# EAGLE design driver (EAGLE 7.4.0)
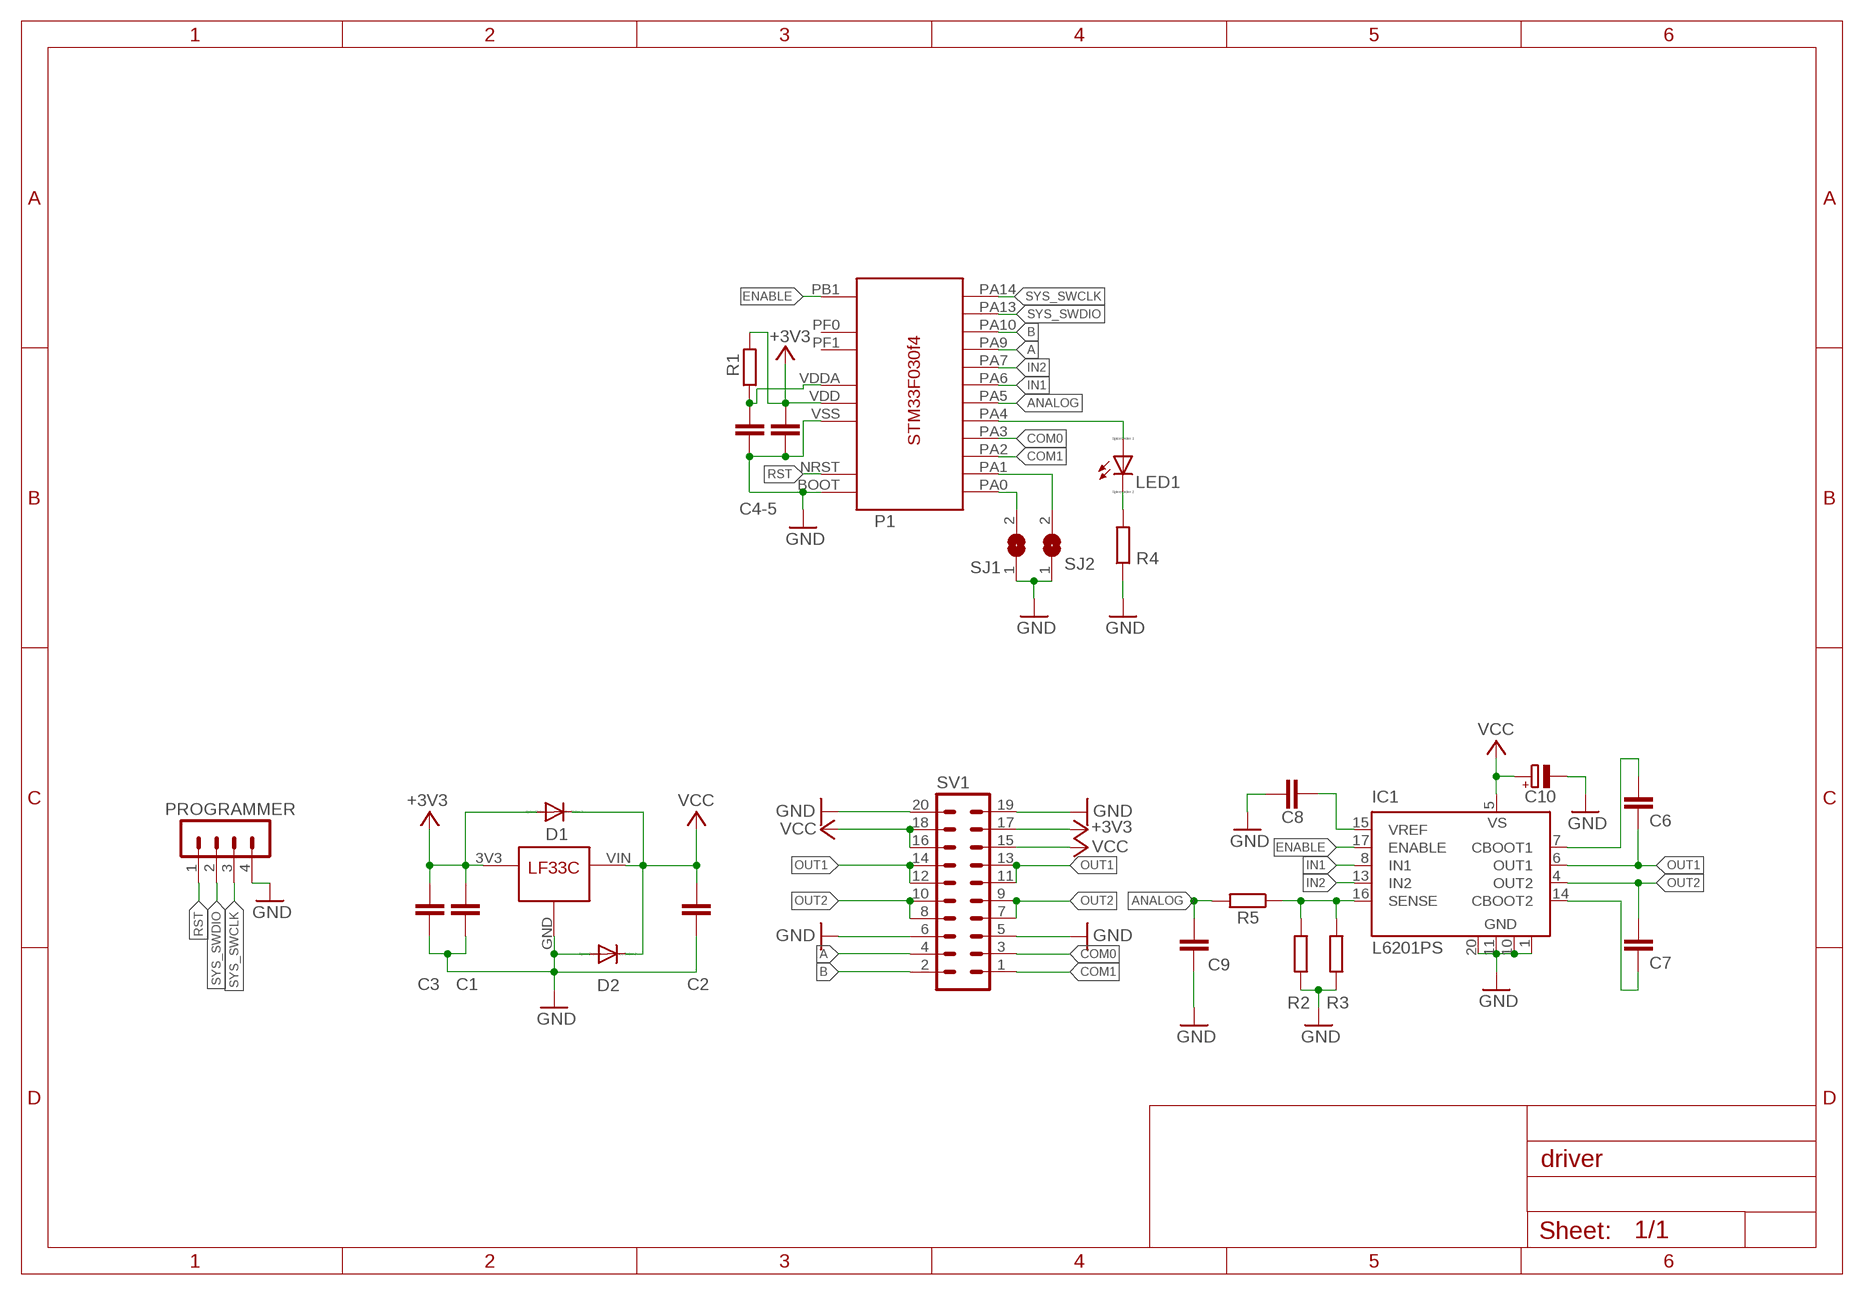
[diagram p0: schematic, sheet 1]

## Parts
C1  220k  C-EUC0603  [C0603]
C2  220k  C-EUC0603  [C0603]
C3  10u  C-EUC1206  [C1206]
C4  100K  C-EUC0603  [C0603]
C5  100K  C-EUC0603  [C0603]
C6  15K  C-EUC0603  [C0603]
C7  15K  C-EUC0603  [C0603]
C8  220k  C-EUC0603  [C0603]
C9  220k  C-EUC0603  [C0603]
C10  CPOL-EUD/7343-31W  [D/7343-31W]
D1  DIODE-MINIMELF  [MINIMELF]
D2  DIODE-MINIMELF  [MINIMELF]
IC1  L6201PS  [POWERSO-20]
LED1  LED_E  [LED_1206]
P1  STM32F030F4  [STM32F030F4]
PROGRAMMER  MA04-1  [MA04-1]
R1  R-EU_R1206  [R1206]
R2  R1  R-EU_R2512  [R2512]
R3  R1  R-EU_R2512  [R2512]
R4  R-EU_R0603  [R0603]
R5  R-EU_R0603  [R0603]
SJ1  SJ  [SJ]
SJ2  SJ  [SJ]
SV1  MA10-2W  [MA10-2W]
U$1  LF33C  [LF33C]

## Nets
+3V3: C1.1 C3.1 C5.1 D1.A P1.VDD R1.2 SV1.17 U$1.3V3
A: P1.PA9 SV1.4
ANALOG: C9.1 P1.PA5 R5.2
B: P1.PA10 SV1.2
COM0: P1.PA3 SV1.3
COM1: P1.PA2 SV1.1
ENABLE: IC1.17(ENABLE) P1.PB1
GND: C1.2 C2.2 C3.2 C4.2 C5.2 C8.2 C9.2 C10.- D2.A IC1.1(GND) IC1.10(GND) IC1.11(GND) IC1.20(GND) P1.BOOT P1.VSS PROGRAMMER.4 R2.1 R3.1 R4.1 SJ1.1 SJ2.1 SV1.5 SV1.6 SV1.19 SV1.20 U$1.GND
IN1: IC1.8(IN1) P1.PA6
IN2: IC1.13(IN2) P1.PA7
N$1: C4.1 P1.VDDA R1.1
N$2: C6.1 IC1.7(CBOOT1)
N$3: LED1.C R4.2
N$4: P1.PA0 SJ1.2
N$5: C7.2 IC1.14(CBOOT2)
N$6: C8.1 IC1.15(VREF)
N$7: P1.PA1 SJ2.2
N$8: LED1.A P1.PA4
N$10: IC1.16(SENSE) R2.2 R3.2 R5.1
OUT1: C6.2 IC1.6(OUT1) SV1.11 SV1.12 SV1.13 SV1.14
OUT2: C7.1 IC1.4(OUT2) SV1.7 SV1.8 SV1.9 SV1.10
RST: P1.NRST PROGRAMMER.1
SYS_SWCLK: P1.PA14 PROGRAMMER.3
SYS_SWDIO: P1.PA13 PROGRAMMER.2
VCC: C2.1 C10.+ D1.C D2.C IC1.5(VS) SV1.15 SV1.16 SV1.18 U$1.VIN
Unconnected: P1.PF0 P1.PF1

## Notes on the sheet
- C4-5

## Library data of the parts
C1-C9 = rcl:C-EU: CAPACITOR, European symbol
C10 = resistor:CPOL-EU: POLARIZED CAPACITOR, European symbol
D1 D2 = diode:DIODE-: DIODE
IC1 = st-microelectronics:L6201: DMOS FULL BRIDGE DRIVER; MF: Arrow Electronics; MPN: L6201PS; OC_FARNELL: 1077146; OC_NEWARK: 89K0751
LED1 = eagle-ltspice:LED_E: LED Source: http://www.osram.convergy.de Source: www.luxeon.com Source: www.kingbright.com; SPICEMODEL: NONE; SPICEPREFIX: D; SPICETYPE: diode
P1 = stm32f030f4:STM32F030F4
PROGRAMMER = con-lstb:MA04-1: PIN HEADER; OC_FARNELL: unknown; OC_NEWARK: unknown
R1-R5 = rcl:R-EU_: RESISTOR, European symbol
SJ1 SJ2 = jumper:SJ: SMD solder JUMPER
SV1 = con-lstb:MA10-2W: PIN HEADER; OC_FARNELL: unknown; OC_NEWARK: unknown
U$1 = regulator:LF33C

## Board
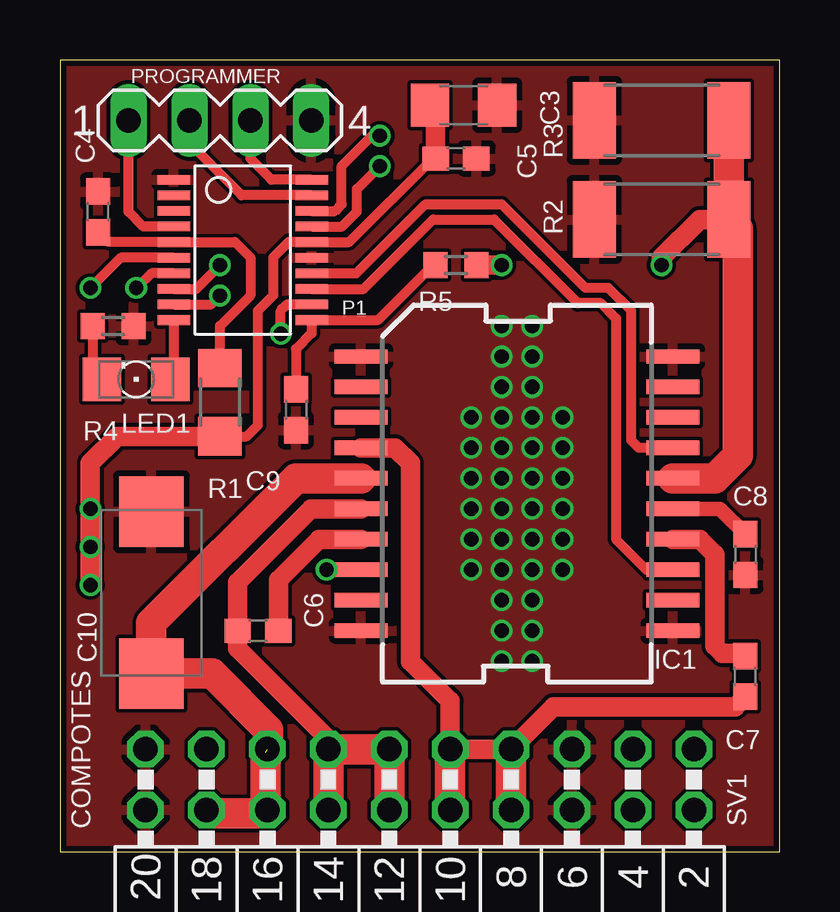
[diagram p1: board, top side]
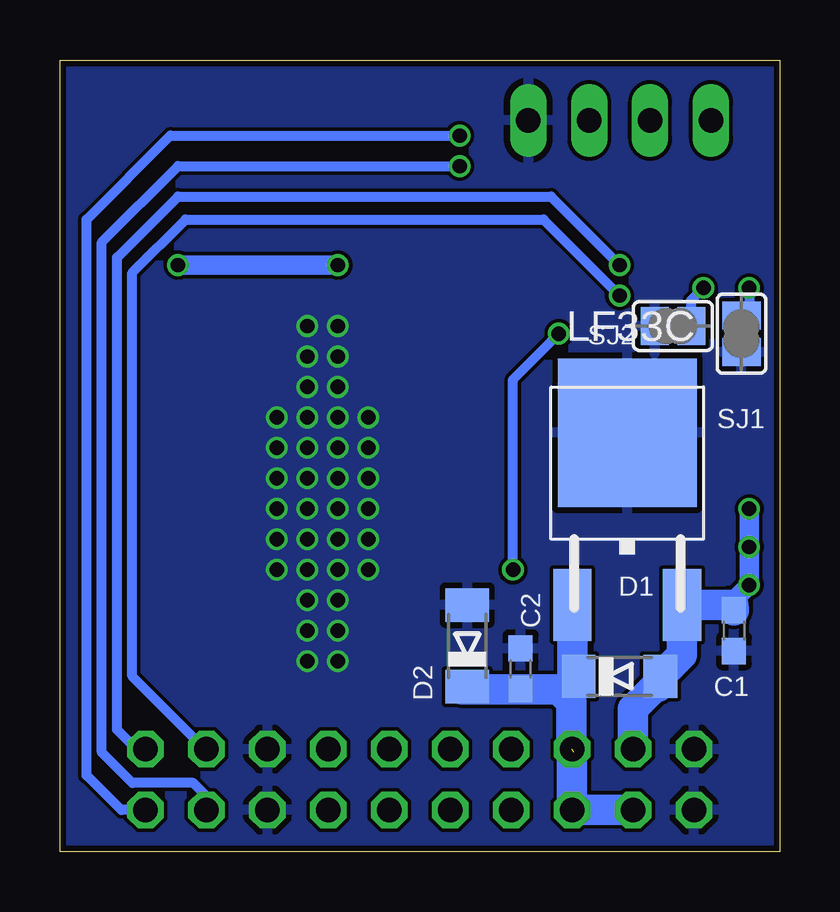
[diagram p2: board, bottom side, seen from below]

Size 30 x 33 mm. Coordinates in mm from the lower left corner, seen from the top.
Outline: 0,0 30,0 30,33 0,33 0,0
Copper layers (1*16): Top 0.035mm / dielectric 1.5mm / Bottom 0.035mm
Design rules "ITEADstudio_DRC": minimum track width 6mil, minimum drill 12mil, track to track 6mil, track to pad 6mil, pad to pad 6mil, via to via 6mil, smd to smd 0mil, copper to edge 10mil, drill to drill 10mil, minimum pad ring 10mil, minimum via ring 6mil, stop-mask expansion 2mil, vias tented up to drill 100mil, thermal gap 10mil

### Footprints (pad centres in the part's own frame; a part is rotated, then mirrored left to right if it is on the bottom)
C0603 = smd 1.1 x 1: 1 -0.85,0; 2 0.85,0
C1206 = smd 1.6 x 1.8: 1 -1.4,0; 2 1.4,0
D/7343-31W = smd 2.95 x 2.7: + 3.375,0; - -3.375,0
MINIMELF = smd 1.4 x 1.8: A 1.7,0; C -1.7,0
POWERSO-20 = smd 0.6 x 2.2: 1 -5.715,-6.5; 2 -4.445,-6.5; 3 -3.175,-6.5; 4 -1.905,-6.5; 5 -0.635,-6.5; 6 0.635,-6.5; 7 1.905,-6.5; 8 3.175,-6.5; 9 4.445,-6.5; 10 5.715,-6.5; 11 5.715,6.5; 12 4.445,6.5; 13 3.175,6.5; 14 1.905,6.5; 15 0.635,6.5; 16 -0.635,6.5; 17 -1.905,6.5; 18 -3.175,6.5; 19 -4.445,6.5; 20 -5.715,6.5
LED_1206 = smd 1.6 x 1.803: A -1.422,0; C 1.422,0
STM32F030F4 = smd 1.35 x 0.4: BOOT -2.875,2.925; NRST -2.875,0.975; PA0 -2.875,-0.325; PA1 -2.875,-0.975; PA2 -2.875,-1.625; PA3 -2.875,-2.275; PA4 -2.875,-2.925; PA5 2.875,-2.925; PA6 2.875,-2.275; PA7 2.875,-1.625; PA9 2.875,0.975; PA10 2.875,1.625; PA13 2.875,2.275; PA14 2.875,2.925; PB1 2.875,-0.975; PF0 -2.875,2.275; PF1 -2.875,1.625; VDD 2.875,0.325; VDDA -2.875,0.325; VSS 2.875,-0.325
MA04-1 = drill 1.016 long: 1 -3.81,0; 2 -1.27,0; 3 1.27,0; 4 3.81,0
R1206 = smd 1.6 x 1.803: 1 -1.422,0; 2 1.422,0
R2512 = smd 1.8 x 3.2: 1 -2.8,0; 2 2.8,0
R0603 = smd 1 x 1.1: 1 -0.85,0; 2 0.85,0
SJ = smd 1.168 x 1.6: 1 -0.762,0; 2 0.762,0
MA10-2W = drill 1.016 octagon: 1 -11.43,-1.27; 2 -11.43,1.27; 3 -8.89,-1.27; 4 -8.89,1.27; 5 -6.35,-1.27; 6 -6.35,1.27; 7 -3.81,-1.27; 8 -3.81,1.27; 9 -1.27,-1.27; 10 -1.27,1.27; 11 1.27,-1.27; 12 1.27,1.27; 13 3.81,-1.27; 14 3.81,1.27; 15 6.35,-1.27; 16 6.35,1.27; 17 8.89,-1.27; 18 8.89,1.27; 19 11.43,-1.27; 20 11.43,1.27
LF33C = smd 1.6 x 3: 3V3 2.285,-7.18; VIN -2.285,-7.18 | smd 5.8 x 6.2: GND 0,0

### Placement (x,y rotation side)
C1  1.91,9.21 270 bottom
C2  10.79,7.62 90 bottom
C3  16.83,31.11 0 top
C4  1.59,26.67 90 top
C5  16.51,28.89 0 top
C6  8.26,9.21 180 top
C7  28.57,7.3 90 top
C8  28.57,12.38 270 top
C9  9.84,18.41 270 top
C10  3.81,10.79 270 top
D1  6.67,7.3 0 bottom
D2  13.02,8.57 90 bottom
IC1  19.05,14.92 270 top
LED1  3.17,19.68 180 top
P1  7.62,25.08 0 top
PROGRAMMER  6.67,30.48 0 top
R1  6.67,18.73 270 top
R2  25.08,26.35 0 top
R3  25.08,30.48 0 top
R4  2.22,21.91 180 top
R5  16.51,24.45 180 top
SJ1  1.59,21.59 90 bottom
SJ2  4.45,21.91 0 bottom
SV1  15,3 180 top
U$1  6.35,17.46 0 bottom

### Tracks (layer width: path | path; a pad name or v marks a point on that pad's centre or on a via)
+3V3  (via drill 0.6)
  Top 0.406: R1.2 7.79,17.31 8.26,17.78 8.26,22.54 8.89,23.18 8.89,24.77 9.53,25.41 P1.VDD 12.06,25.41 15.54,28.89 C5.1
  Top 0.813: v1.27,11.11 1.27,16.19 2.39,17.31 R1.2 | C3.1 15.66,30.57 C5.1
  Bottom 0.813: 2.1,10.28 v1.27,11.11 v1.27,12.7 v1.27,14.29
  Bottom 1.27: SV1.17 6.11,5.96 5.08,6.99 5.08,6.87 D1.A 4.07,8.21 U$1.3V3 2.1,10.28 1.93,10.28 C1.1
A  (via drill 0.6)
  Top 0.406: P1.PA9 11.77,26.06 12.38,26.67 12.38,27.62 v13.34,28.57
  Bottom 0.406: SV1.4 23.89,2.3 24.45,2.86 26.99,2.86 28.26,4.13 28.26,25.4 25.08,28.57 v13.34,28.57
ANALOG
  Top 0.406: P1.PA5 10.54,22.16 | P1.PA5 10.49,21.61 9.84,20.95 C9.1 | P1.PA5 13.27,22.16 15.34,24.23 R5.2
B  (via drill 0.6)
  Top 0.406: P1.PA10 11.47,26.71 11.75,26.99 11.75,28.57 13.02,29.84 v13.34,29.84
  Bottom 0.406: SV1.2 27.45,1.73 28.89,3.17 28.89,26.35 25.4,29.84 v13.34,29.84
COM0  (via drill 0.6)
  Top 0.406: P1.PA3 6.3,22.81 v6.67,23.18
  Bottom 0.406: v6.67,23.18 9.84,26.35 24.77,26.35 26.99,24.13 26.99,7.3 23.95,4.27 SV1.3
COM1  (via drill 0.6)
  Top 0.406: P1.PA2 5.68,23.46 v6.67,24.45
  Bottom 0.406: SV1.1 26.81,4.27 27.62,5.08 27.62,24.77 25.08,27.3 9.53,27.3 v6.67,24.45
ENABLE
  Top 0.406: P1.PB1 12.36,24.11 15.24,26.99 18.41,26.99 21.91,23.5 22.86,23.5 23.81,22.54 23.81,17.14 24.13,16.83 IC1.17
GND  (via drill 0.6)
  other vias: 18.41,21.91 19.68,21.91 18.41,20.64 19.68,20.64 19.68,19.37 18.41,19.37 18.41,18.1 19.68,18.1 20.95,18.1 17.14,18.1 17.14,16.83 18.41,16.83 19.68,16.83 20.95,16.83 20.95,15.56 19.68,15.56 18.41,15.56 17.14,15.56 17.14,14.29 18.41,14.29 19.68,14.29 20.95,14.29 20.95,13.02 19.68,13.02 18.41,13.02 17.14,13.02 17.14,11.75 18.41,11.75 19.68,11.75 20.95,11.75 19.68,10.48 18.41,10.48 19.68,9.21 18.41,9.21 19.68,7.94 18.41,7.94
  pour Bottom: 33.02,-2.54 33.02,36.51 -3.81,36.51 -3.81,-2.54
  pour Top: 31.75,-1.27 31.75,35.24 -1.27,35.24 -1.27,-1.27
IN1  (via drill 0.6)
  Top 0.406: P1.PA6 9.47,22.81 9.21,22.54 v9.21,21.59 | IC1.8 v11.11,11.75
  Bottom 0.406: v11.11,11.75 11.11,19.68 v9.21,21.59
IN2
  Top 0.406: IC1.13 24.45,11.75 23.18,13.02 23.18,22.23 22.54,22.86 21.59,22.86 18.1,26.35 15.56,26.35 12.66,23.46 P1.PA7
N$1
  Top 0.406: C4.1 2.02,25.41 P1.VDDA 7.29,25.41 7.94,24.77 7.94,23.18 6.67,21.91 R1.1
N$2
  Top 0.813: C6.1 9.11,11.33 10.79,13.02 IC1.7
N$3
  Top 0.406: R4.2 1.37,20.07 LED1.C
N$4  (via drill 0.6)
  Top 0.406: P1.PA0 2.53,24.76 v1.27,23.5
  Bottom 0.406: v1.27,23.5 1.27,22.67 SJ1.2
N$5
  Top 0.813: IC1.14 26.67,13.02 27.3,12.38 27.3,8.57 27.62,8.26 28.47,8.26 C7.2
N$6
  Top 0.61: IC1.15 27.52,14.29 C8.1
N$7  (via drill 0.6)
  Top 0.406: P1.PA1 3.83,24.11 v3.17,23.5
  Bottom 0.406: SJ2.2 3.68,22.99 v3.17,23.5
N$8
  Top 0.406: P1.PA4 4.75,20.47 LED1.A
N$10  (via drill 0.6)
  Top 0.813: v25.08,24.45 25.08,24.77 26.67,26.35 R2.2 | v18.41,24.45 R5.1
  Top 1.27: IC1.16 27.3,15.56 28.26,16.51 28.26,25.98 R2.2 R3.2
  Bottom 0.813: v25.08,24.45 v18.41,24.45
OUT1
  Top 0.813: IC1.6 10.48,14.29 7.41,11.21 C6.2 7.41,8.47 11.19,4.68 SV1.13
  Top 1.27: SV1.14 SV1.13 SV1.11 SV1.12
OUT2
  Top 0.813: IC1.4 13.97,16.83 14.61,16.19 14.61,7.94 16.27,6.27 SV1.9 SV1.7 18.88,4.27 18.88,4.33 20.57,6.03 28.16,6.03 C7.1 28.57,6.35
  Top 1.27: SV1.10 SV1.9 | SV1.8 SV1.7
RST
  Top 0.406: PROGRAMMER.1 2.86,26.67 3.47,26.06 P1.NRST
SYS_SWCLK
  Top 0.406: P1.PA14 8.82,28.01 7.94,28.89 PROGRAMMER.3
SYS_SWDIO
  Top 0.406: P1.PA13 7.57,27.36 5.4,29.53 PROGRAMMER.2
VCC  (1 unrouted)
  Top 1.27: SV1.15 8.69,4.94 8.69,5.08 6.34,7.42 C10.+ 3.81,9.53 9.84,15.56 IC1.5 | 8.57,4.13 8.57,1.59 6.03,1.59
  Bottom 1.27: U$1.VIN 8.63,6.72 D1.C 8.9,6.45 | 8.9,6.45 8.69,6.24 8.69,4.3 SV1.15 SV1.16 SV1.18 | 8.9,6.45 9.22,6.77 C2.1 13.23,6.77 D2.C

### Text on the board
tNames: COMPOTES